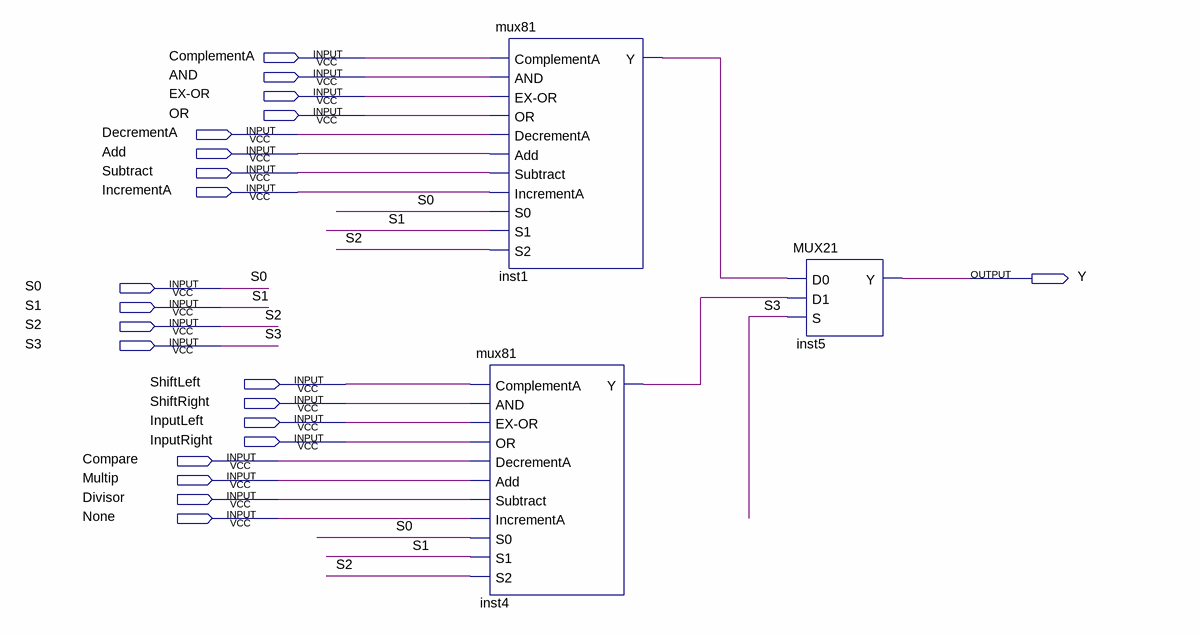
[diagram p0: schematic sheet]
// Quartus schematic mux161.bdf as structural Verilog: 3 symbols, 21 pins
module mux161 (
  input  ComplementA,
  input  AND,
  input  \EX-OR ,
  input  OR,
  input  DecrementA,
  input  Add,
  input  Subtract,
  input  IncrementA,
  input  S0,
  input  S1,
  input  S2,
  input  S3,
  input  ShiftLeft,
  input  ShiftRight,
  input  InputLeft,
  input  InputRight,
  input  Compare,
  input  Multip,
  input  Divisor,
  input  None,
  output Y
);

  wire inst1_y, inst4_y;

  mux81 inst1 (
    .ComplementA(ComplementA), .AND(AND), .\EX-OR (\EX-OR ), .OR(OR), .DecrementA(DecrementA), .Add(Add),
    .Subtract(Subtract), .IncrementA(IncrementA), .S0(S0), .S1(S1), .S2(S2), .Y(inst1_y));
  mux81 inst4 (
    .ComplementA(ShiftLeft), .AND(ShiftRight), .\EX-OR (InputLeft), .OR(InputRight), .DecrementA(Compare),
    .Add(Multip), .Subtract(Divisor), .IncrementA(None), .S0(S0), .S1(S1), .S2(S2), .Y(inst4_y));
  MUX21 inst5 (.D0(inst1_y), .D1(inst4_y), .S(S3), .Y(Y));
endmodule
